# Altium schematic sheet GSM_GPS.SchDoc
size A4
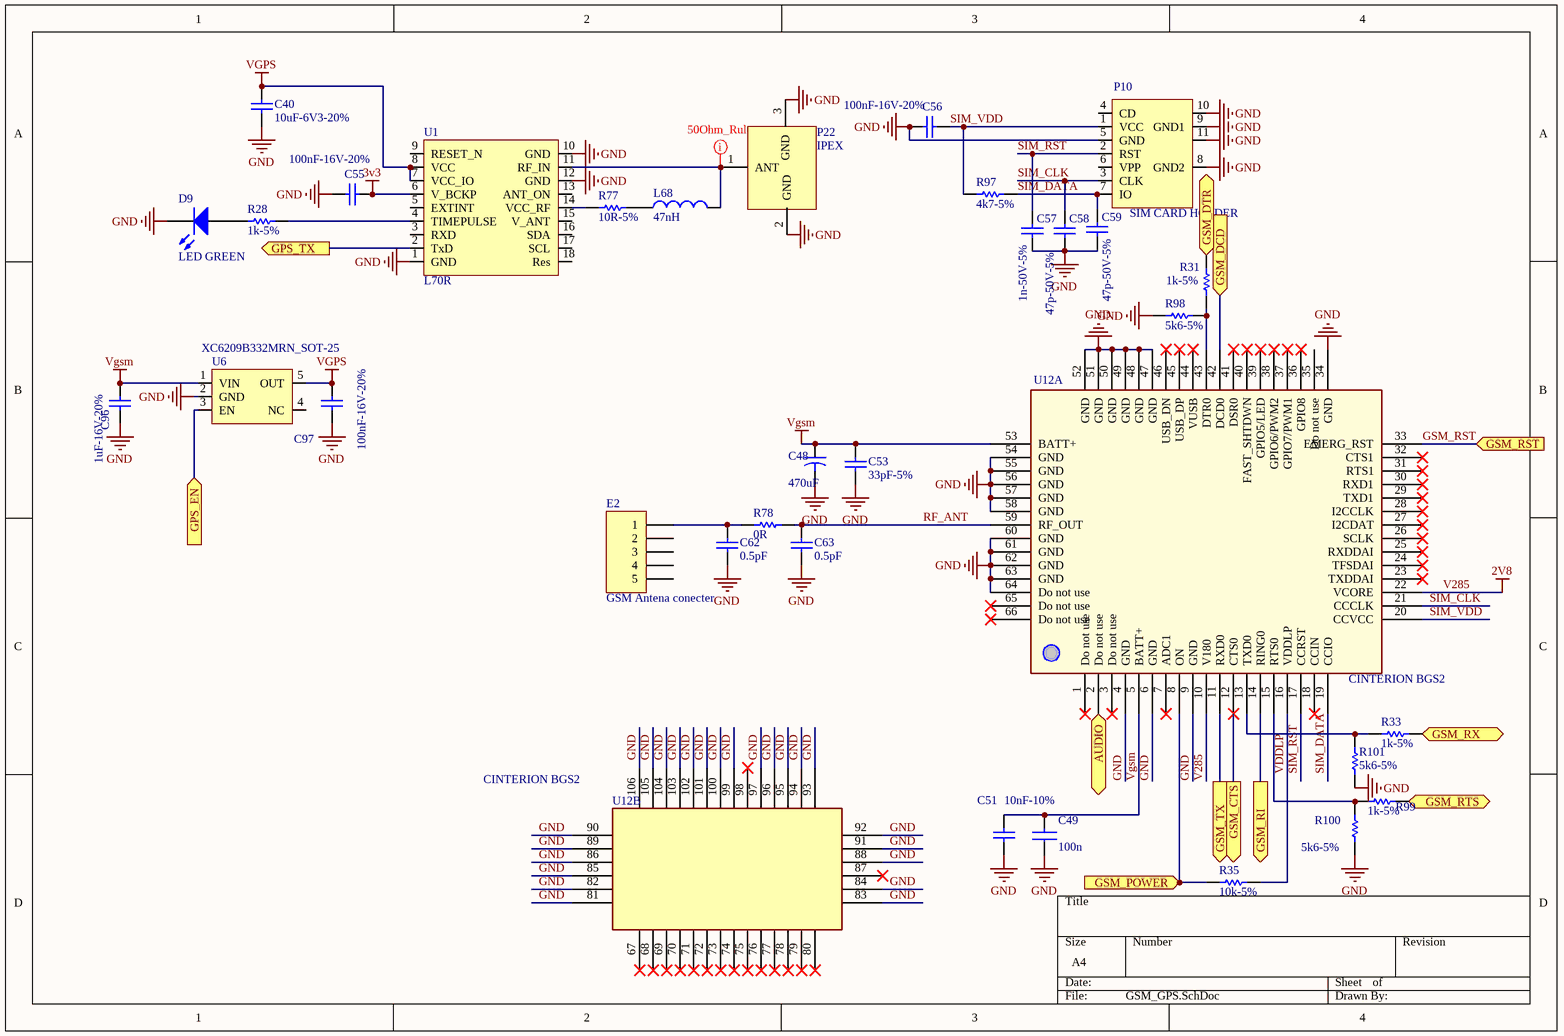
[diagram p0: GSM_GPS.SchDoc]

## Parts
C40  10uF-6V3-20%  [C0603]
C48  470uF  [C2917_smd]
C49  100n  [0402_TYPE1]
C51  10nF-10%  [0402_TYPE1]
C53  33pF-5%  [0402_TYPE1]
C55  100nF-16V-20%  [0402_TYPE1]
C56  100nF-16V-20%  [0402_TYPE1]
C57  1n-50V-5%  [0402_TYPE1]
C58  47p-50V-5%  [0402_TYPE1]
C59  47p-50V-5%  [0402_TYPE1]
C62  0.5pF  [0402_TYPE1]
C63  0.5pF  [0402_TYPE1]
C96  1uF-16V-20%  [C0603]
C97  100nF-16V-20%  [0402_TYPE1]
D9  LED GREEN  [LED0603-G]
E2  GSM Antena conecter  [A10343-GSM850/900/1800/1900/WCDMA]
L68  47nH  [C0603]
P10  SIM CARD HOLDER  [SIM MF01-412-063X]
P22  IPEX  [IPEX]
R28  1k-5%  [R0402_TYPE1]
R31  1k-5%  [R0402_TYPE1]
R33  1k-5%  [R0402_TYPE1]
R35  10k-5%  [R0402_TYPE1]
R77  10R-5%  [R0402_TYPE1]
R78  0R  [R0402_TYPE1]
R97  4k7-5%  [R0402_TYPE1]
R98  5k6-5%  [R0402_TYPE1]
R99  1k-5%  [R0402_TYPE1]
R100  5k6-5%  [R0402_TYPE1]
R101  5k6-5%  [R0402_TYPE1]
U1  L70R  [MAX7]
U6  XC6209B332MRN_SOT-25  [SOT23-5]
U12  CINTERION BGS2  [CINTERION BGS2]  (parts A,B of 2)

## Ports
AUDIO (out), GPS_EN (in), GPS_TX (out), GSM_CTS (out), GSM_DCD (in), GSM_DTR (in), GSM_POWER (in), GSM_RI (out), GSM_RST (in), GSM_RTS (in), GSM_RX (in), GSM_TX (out)

## Nets
3v3: C55.1 U1.6(V_BCKP)
GND: C40.1 C48.2 C49.1 C51.1 C53.2 C55.2 C56.2 C57.1 C58.1 C59.1 C62.1 C63.1 C96.1 C97.1 D9.2(K) P10.5(GND) P10.8(GND2) P10.9(GND1) P10.10(GND3) P10.11(GND4) P22.2(GND) P22.3(GND) R98.2 R100.2 R101.2 U1.1(GND) U1.10(GND) U1.12(GND) U6.2(GND) U12.4(GND) U12.6(GND) U12.9(GND) U12.34(GND) U12.47(GND) U12.48(GND) U12.49(GND) U12.50(GND) U12.51(GND) U12.52(GND) U12.54(GND) U12.55(GND) U12.56(GND) U12.57(GND) U12.58(GND) U12.60(GND) U12.61(GND) U12.62(GND) U12.63(GND) U12.64(Do_not_use) U12.81(GND) U12.82(GND) U12.83(GND) U12.84(GND) U12.85(GND) U12.86(GND) U12.88(GND) U12.89(GND) U12.90(GND) U12.91(GND) U12.92(GND) U12.93(GND) U12.94(GND) U12.95(GND) U12.96(GND) U12.97(GND) U12.99(GND) U12.100(GND) U12.101(GND) U12.102(GND) U12.103(GND) U12.104(GND) U12.105(GND) U12.106(GND)
V285: U12.10(V180) U12.22(VCORE)  [also labelled 2V8]
VGPS: C40.2 C97.2 U1.7(VCC_IO) U1.8(VCC) U6.5(OUT)
Vgsm: C48.1 C49.2 C51.2 C53.1 C96.2 U6.1(VIN) U12.5(BATT+) U12.53(BATT+)
AUDIO: U12.2(Do_not_use) ; port AUDIO
GPS_EN: U6.3(EN) ; port GPS_EN
GPS_TX: U1.2(TxD) ; port GPS_TX
GSM_CTS: U12.12(CTS0) ; port GSM_CTS
GSM_DCD: U12.42(DCD0) ; port GSM_DCD
GSM_DTR: R31.1 ; port GSM_DTR
GSM_POWER: R35.1 U12.8(ON) ; port GSM_POWER
GSM_RI: U12.14(RING0) ; port GSM_RI
GSM_RST: U12.33(EMERG_RST) ; port GSM_RST
GSM_RTS: R99.2 ; port GSM_RTS
GSM_RX: R33.2 ; port GSM_RX
GSM_TX: U12.11(RXD0) ; port GSM_TX
RF_ANT: C63.2 R78.1 U12.59(RF_OUT)
SIM_CLK: C58.2 P10.3(CLK) U12.21(CCCLK)
SIM_DATA: C59.2 P10.7(IO) R97.1 U12.19(CCIO)
SIM_RST: C57.2 P10.2(RST) U12.17(CCRST)
SIM_VDD: C56.1 P10.1(VCC) R97.2 U12.20(CCVCC)
VDDLP: R35.2 U12.16(VDDLP)
NetC62_2: C62.2 E2.1 R78.2
NetD9_1: D9.1(A) R28.2
NetL68_1: L68.1 R77.1
NetL68_2: L68.2 P22.1(ANT) U1.11(RF_IN)
NetR28_1: R28.1 U1.4(TIMEPULSE)
NetR31_2: R31.2 R98.1 U12.43(DTR0)
NetR33_1: R33.1 R101.1 U12.13(TXD0)
NetR77_2: R77.2 U1.14(VCC_RF)
NetR99_1: R99.1 R100.1 U12.15(RTS0)

Not connected (* = marked no-connect by the designer): E2 2 3 4 5; P10 4(CD) 6(VPP); U1 3(RXD) 5(EXTINT) 9(RESET_N) 13(ANT_ON) 15(V_ANT) 16(SDA) 17(SCL) 18(Res); U6 4(NC); U12 1(Do_not_use)* 3(Do_not_use)* 7(ADC1)* 18(CCIN)* 23(TXDDAI)* 24(TFSDAI)* 25(RXDDAI)* 26(SCLK)* 27(I2CDAT)* 28(I2CCLK)* 29(TXD1)* 30(RXD1)* 31(RTS1)* 32(CTS1)* 35(Do_not_use) 36(GPIO8)* 37(GPIO7/PWM1)* 38(GPIO6/PWM2)* 39(GPIO5/LED)* 40(FAST_SHTDWN)* 41(DSR0)* 44(VUSB)* 45(USB_DP)* 46(USB_DN)* 65(Do_not_use)* 66(Do_not_use)* 67(GND)* 68(GND)* 69(GND)* 70(GND)* 71(GND)* 72(GND)* 73(GND)* 74(GND)* 75(GND)* 76(GND)* 77(GND)* 78(GND)* 79(GND)* 80(GND)* 87(GND)* 98(GND)*

## Layout directives
rule Width Constraint [Pref Width = 26mil    Min Width = 26mil    Max Width = 26mil]; rule Clearance Constraint [Clearance = 10mil]: NetL68_2

## Library data of the parts
C40 = Cap: CAP CER 10UF 6.3V 20% X5R 0603; Manufacturer: Murata Electronics North America; Manufacturer Part Number: GRM188R60J106ME47D; Published: 8-Jun-2000; LatestRevisionDate: 17-Jul-2002; LatestRevisionNote: Re-released for DXP Platform.; PackageReference: C0603; Publisher: Altium Limited; Value: 10uF-6V3-20%; Digi-Key Part Number: 490-3896-1-ND; Unit Price: 0.07873
C48 = Cap2: CAP TANT 470UF 6.3V 10% 2917; Manufacturer: Kemet; Manufacturer Part Number: T495D477K006ATE100; Published: 23-Sep-2002; PackageReference: CAPR5-4X5; Publisher: Altium Limited; Value: 470uF; Digi-Key Part Number: 399-4701-2-ND; Unit Price: 0.5
C49 = CAP NP: CAP CER 0.1UF 16V 10% X7R 0805; Manufacturer: Yageo; Manufacturer Part Number: CC0805KRX7R7BB104; Digi-Key Part Number: 311-1142-2-ND; Unit Price: 0.003800
C51 = 10nF-50V-C0805: Non-Polarized Capacitor; Manufacturer: Yageo; Manufacturer Part Number: CC0805KRX7R9BB103; Value: 10nF-10%; Digi-Key Part Number: 311-1136-1-ND; Unit Price: 0.1
C53 = 33pF-50V-C0805: Non-Polarized Capacitor; Manufacturer: Yageo; Manufacturer Part Number: CC0805JRNPO9BN330; Value: 33pF-5%; Digi-Key Part Number: 311-1105-1-ND; Unit Price: 0.1
C55 C56 C97 = Cap: CAP CER 0.1UF 16V Y5V 0402; Manufacturer: Yageo; Manufacturer Part Number: CC0402ZRY5V7BB104; Published: 8-Jun-2000; LatestRevisionDate: 17-Jul-2002; LatestRevisionNote: Re-released for DXP Platform.; PackageReference: C0402; Publisher: Altium Limited; Value: 100nF-16V-20%; Digi-Key Part Number: 311-1047-1-ND; Unit Price: 0.00250
C57-C59 = Cap: CAP CER 47PF 50V 5% NPO 0402; Manufacturer: Yageo; Manufacturer Part Number: CC0402JRNPO9BN470; Published: 8-Jun-2000; LatestRevisionDate: 17-Jul-2002; LatestRevisionNote: Re-released for DXP Platform.; PackageReference: C0603; Publisher: Altium Limited; Digi-Key Part Number: 311-1021-1-ND; Unit Price: 0.00270
  C57: Value: 1n-50V-5%
  C58 C59: Value: 47p-50V-5%
C62 C63 = 0.5pF-50V-C0805: Non-Polarized Capacitor; Manufacturer: Yageo; Manufacturer Part Number: CC0805CRNPO9BNR50; Value: 0.5pF; Digi-Key Part Number: 311-1094-1-ND; Unit Price: 0.1
C96 = Cap: CAP CER 1UF 16V Y5V 0603; Manufacturer: Yageo; Manufacturer Part Number: CC0603ZRY5V7BB105; Published: 8-Jun-2000; LatestRevisionDate: 17-Jul-2002; LatestRevisionNote: Re-released for DXP Platform.; PackageReference: C0603; Publisher: Altium Limited; Value: 1uF-16V-20%; Digi-Key Part Number: 311-1372-1-ND; Unit Price: 0.00465
D9 = LED2: LED GREEN CLEAR THIN 0603 SMD; Manufacturer: Lite-On Inc; Manufacturer Part Number: LTST-C191KGKT; Published: 8-Jun-2000; LatestRevisionDate: 17-Jul-2002; LatestRevisionNote: Re-released for DXP Platform.; PackageVersion: Feb-2002; PackageReference: 3.2X1.6X1.1; Publisher: Altium Limited; Digi-Key Part Number: 160-1446-2-ND; Unit Price: 0.03780; Value: LED GREEN
E2 = Header 5: Header, 5-Pin; LatestRevisionDate: 17-Jul-2002; LatestRevisionNote: Re-released for DXP Platform.; Publisher: Altium Limited
L68 = Inductor: Code_IEC: 1005; Published: 8-Jun-2000; LatestRevisionDate: 29-May-2009; LatestRevisionNote: IPC-7351 Footprint Added.; PackageReference: 0402-A; Publisher: Altium Limited; PackageDescription: Chip Inductor; Code_JEITA: 0402; Value: 47nH
P10 = SIM CARD: SIM _CONNECTOR_410108105011-2LF; Manufacturer: Tyrone
R28 R31 R33 R99 = Res1: RES 1.0K OHM 1/16W 5% 0402 SMD; Manufacturer: Yageo; Manufacturer Part Number: RC0402JR-071KL; Published: 8-Jun-2000; LatestRevisionDate: 17-Jul-2002; LatestRevisionNote: Re-released for DXP Platform.; PackageReference: R0603; Publisher: Altium Limited; Value: 1k-5%; Digi-Key Part Number: 311-1.0KJRCT-ND; Unit Price: 0.00178
R35 = Res1: RES 10K OHM 1/16W 5% 0402 SMD; Manufacturer: Yageo; Manufacturer Part Number: RC0402JR-0710KL; Published: 8-Jun-2000; LatestRevisionDate: 17-Jul-2002; LatestRevisionNote: Re-released for DXP Platform.; PackageReference: R0603; Publisher: Altium Limited; Value: 10k-5%; Digi-Key Part Number: 311-10KJRCT-ND; Unit Price: 0.00178
R77 = 10R-5%-R0402: RES 10 OHM 1/16W 5% 0402 SMD; Manufacturer: Yageo; Manufacturer Part Number: RC0402JR-0710RL; Digi-Key Part Number: 311-10JRTR-ND; Unit Price: 0.00130
R78 = 0R-0805
R97 R98 R100 R101 = Res1: RES 4.7K OHM 1/16W 5% 0402 SMD; Manufacturer: Yageo; Manufacturer Part Number: RC0402JR-074K7L; Published: 8-Jun-2000; LatestRevisionDate: 17-Jul-2002; LatestRevisionNote: Re-released for DXP Platform.; PackageReference: R0603; Publisher: Altium Limited; Digi-Key Part Number: 311-4.7KJRCT-ND; Unit Price: 0.00178
  R97: Value: 4k7-5%
  R98 R100 R101: Value: 5k6-5%
U1 = MAX-7
U6 = XC6209B332MRN_SOT-25: Manufacturer: Tyrone
U12 = CINTERION EHS5: Name: BGS2